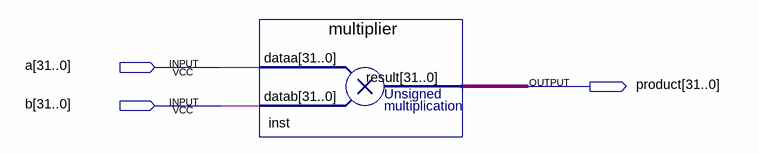
[diagram p0: schematic sheet]
// Quartus schematic multiplier.bdf as structural Verilog: 1 symbols, 3 pins
module multiplier (
  input  [31:0] a,
  input  [31:0] b,
  output [31:0] product
);

  multiplier inst (.dataa(a), .datab(b), .result(product));
endmodule
